# Altium schematic sheet MonitorAmp.SchDoc: Current Sensing Amplifier for Monitor Outputs (slow)
size A; Author: Enrique Morell; DrawnBy: Enrique Morell; Engineer: Enrique Morell; DocumentNumber: 6; Revision: v0.1; SheetNumber: 6; SheetTotal: 9
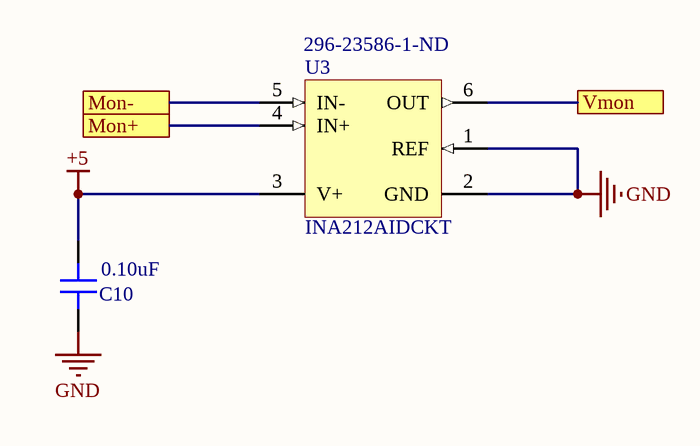
[diagram p0: MonitorAmp.SchDoc]

## Parts
C10  0.10uF  [CAP 0402/1005]
U3  INA212AIDCKT  Supplier Part Number 1: 296-23586-1-ND  [DCK0006A_L]

## Ports
Mon+, Mon-, Vmon

## Nets
+5: C10.2 U3.3(V+)
GND: C10.1 U3.1(REF) U3.2(GND)
Mon+: U3.4(IN+) ; port Mon+
Mon-: U3.5(IN-) ; port Mon-
Vmon: U3.6(OUT) ; port Vmon

## Library data of the parts
C10 = GRM155R71C104JA88D: CAP CER 0.1UF 16V X7R 0402; Manufacturer: Murata Electronics North America; TemperatureRange: -55C ~ 125C; Tolerance: 5%; Value: 0.10uF; Part Number: GRM155R71C104JA88D; PartId: 12366; Supplier 1: Digi-Key; Supplier Part Number 1: 490-6327-2-ND; ComponentLink1Description: Datasheet; ComponentLink1URL: http://www.murata.com/~/media/webrenewal/support/library/catalog/products/capacitor/mlcc/c02e.pdf; ComponentLink2Description: Digi-Key Listing; ComponentLink2URL: https://www.digikey.com/product-detail/en/murata-electronics-north-america/GRM155R71C104JA88D/490-6327-2-ND/2610891; TemperatureCoefficient: X7R; Voltage: 16V; Price: 0.0046; Device Package: 0402 (1005 Metric)
U3 = CMP-2000-06456-1: Voltage Output, High / Low-Side Measurement, Bi-Directional Zero-Drift Series, Current Shunt Monitor, 2.7 to 26 V, -40 to 125 degC, 6-Pin SOT-23 (DCK6), Green (RoHS & no Sb/Br), Tape and Reel; Manufacturer 1: Texas Instruments; Package Version: 4093553-4/G, 01/2007; Development Kit: INA210-214EVM; Unit Weight: 0.000088oz; Vcm - Common Mode Voltage: -0.3Vto+26V; Gain V/V: 100V/V; Operating Supply Current: 115uA; Topology: CurrentShuntFeedback; Number of Channels: 1Channel; Accuracy: 1%; Amplifier Type: CurrentSense; Gain Error: 0.02%; Vos - Input Offset Voltage: 60uV; Brand: TexasInstruments; Supply Voltage - Max: 26V; CMRR - Common Mode Rejection Ratio: 105dB; Supply Voltage - Min: 2.7V; GBP - Gain Bandwidth Product: 30kHz; Input Offset Voltage (Vos): 35uV; Input Bias Current: 35uA; Gain Bandwidth Product: 4kHz; Unity Gain Bandwidth Product: 14kHz; Nominal Supply Current: 65uA; Number of Elements: 1; Voltage Gain: 60dB; Power Supply Rejection Ratio (PSRR): 140dB; Slew Rate: 0.04V/µs; Operating Supply Voltage: 24V; Min Input Voltage: -300mV; Product Category: CurrentSenseAmplifiers; Series: INA214; Mounting Style: SMD/SMT; Datasheet URL: http://www.ti.com/lit/gpn/INA214?keyMatch=INA214AIDCKT&tisearch=Search-EN-Everything; Maximum Operating Temperature: +125C; Package / Case: SOT-23-6; Minimum Operating Temperature: -40C; Datasheet Version: Rev. G, 07/2014; RoHS: True; Manufacturer URL: http://www.ti.com/; Package Description: 6-Pin Plastic Small Outline, Body 2 x 1.25 mm, Pitch 0.65 mm; Product: CurrentSenseAmplifiers; Package Reference: DCK6; Packaging: Reel; Manufacturer: TexasInstruments; Mounting Technology: SurfaceMount; Supplier 1: Digi-Key; Manufacturer Part Number 1: INA212AIDCKT; Stock 1: 3857; Pricing 1: 1=1.54000, 10=1.38100, 100=1.11010 (USD); Mount: Surface Mount; Case/Package: SC; Number of Pins: 6; Weight: 8.8E-05oz; Min Operating Temperature: -40°C; Max Operating Temperature: 125°C; Package Quantity: 1; Max Supply Voltage: 26V; Min Supply Voltage: 2.7V; Common Mode Rejection Ratio: 105dB; Bandwidth: 14kHz; Max Input Voltage: 26V; Number of Amplifiers: 1; Termination: SMD/SMT; Length: 2mm; Height: 0.9mm; Width: 1.25mm; Radiation Hardening: No; Lead Free: Lead Free; REACH SVHC: No SVHC; ComponentLink1URL: https://datasheet.ciiva.com/15132/getdatasheetpartid-49972-15132526.pdf?src-supplier=Verical; ComponentLink1Description: https://datasheet.ciiva.com/15132/getdatasheetpartid-49972-15132526.pdf?src-supplier=Verical; ComponentLink2URL: https://datasheet.ciiva.com/2978/ina213-2978003.pdf?src-supplier=Avnet; ComponentLink2Description: https://datasheet.ciiva.com/2978/ina213-2978003.pdf?src-supplier=Avnet; ComponentLink3URL: https://datasheet.ciiva.com/2976/ina213-2976375.pdf?src-supplier=Avnet; ComponentLink3Description: https://datasheet.ciiva.com/2976/ina213-2976375.pdf?src-supplier=Avnet; ComponentLink4URL: https://datasheet.ciiva.com/1484/1848953-1484619.pdf?src-supplier=Element14; ComponentLink4Description: https://datasheet.ciiva.com/1484/1848953-1484619.pdf?src-supplier=Element14; ComponentLink5URL: https://datasheet.ciiva.com/1939/ina211-1939836.pdf?src-supplier=Digi-Key; ComponentLink5Description: https://datasheet.ciiva.com/1939/ina211-1939836.pdf?src-supplier=Digi-Key; ComponentLink6URL: https://datasheet.ciiva.com/1939/ina211-1939837.pdf?src-supplier=Digi-Key; ComponentLink6Description: https://datasheet.ciiva.com/1939/ina211-1939837.pdf?src-supplier=Digi-Key; ComponentLink7URL: https://datasheet.ciiva.com/1939/ina211-1939838.pdf?src-supplier=Digi-Key; ComponentLink7Description: https://datasheet.ciiva.com/1939/ina211-1939838.pdf?src-supplier=Digi-Key